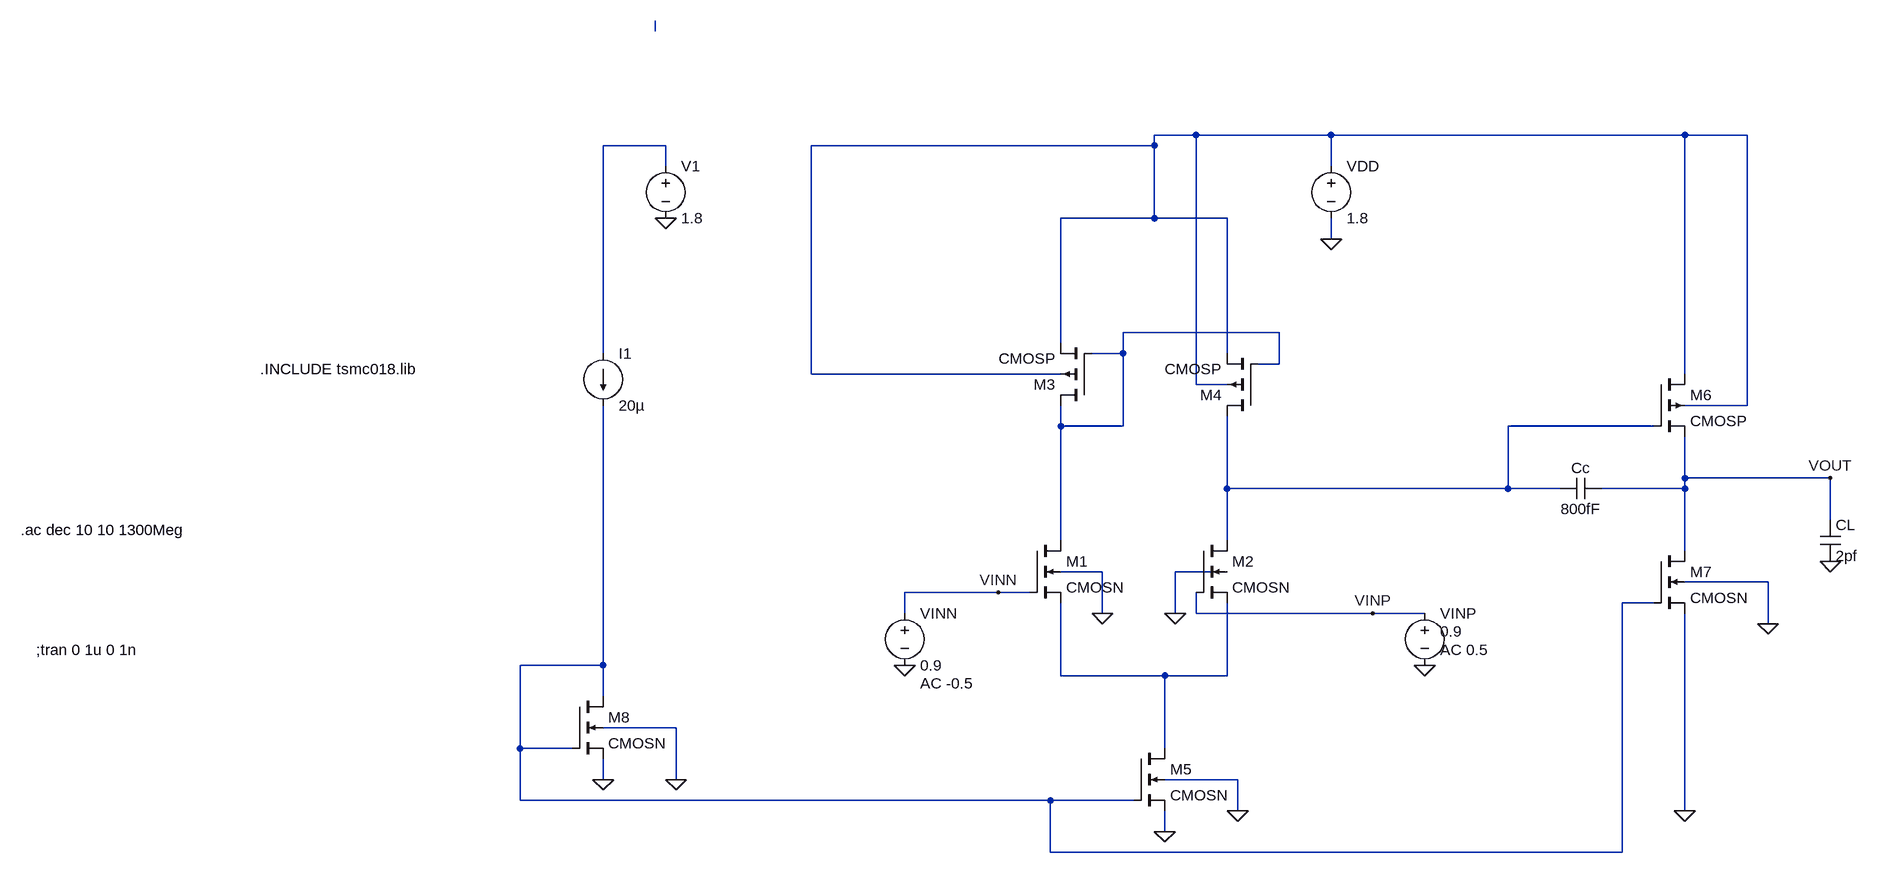
[diagram p0: schematic Draft3.asc]
Draft3.asc, the LTspice schematic file:
Version 4
SHEET 1 1328 784
WIRE -560 -704 -560 -720
WIRE 272 -544 208 -544
WIRE 480 -544 272 -544
WIRE 1024 -544 480 -544
WIRE 1120 -544 1024 -544
WIRE -544 -528 -640 -528
WIRE 208 -528 208 -544
WIRE 208 -528 -320 -528
WIRE -544 -496 -544 -528
WIRE 480 -496 480 -544
WIRE 208 -416 208 -528
WIRE 208 -416 64 -416
WIRE 320 -416 208 -416
WIRE 480 -384 480 -416
WIRE 400 -240 160 -240
WIRE 64 -224 64 -416
WIRE -640 -208 -640 -528
WIRE 160 -208 160 -240
WIRE 160 -208 112 -208
WIRE 320 -208 320 -416
WIRE 400 -192 400 -240
WIRE 400 -192 368 -192
WIRE -320 -176 -320 -528
WIRE 64 -176 -320 -176
WIRE 1024 -176 1024 -544
WIRE 272 -160 272 -544
WIRE 320 -160 272 -160
WIRE 1120 -128 1120 -544
WIRE 1120 -128 1024 -128
WIRE 64 -96 64 -128
WIRE 160 -96 160 -208
WIRE 160 -96 64 -96
WIRE 976 -96 752 -96
WIRE 1024 -16 1024 -80
WIRE 1248 -16 1024 -16
WIRE 320 0 320 -112
WIRE 752 0 752 -96
WIRE 752 0 320 0
WIRE 832 0 752 0
WIRE 1024 0 1024 -16
WIRE 1024 0 896 0
WIRE 1248 48 1248 -16
WIRE 64 80 64 -96
WIRE 320 80 320 0
WIRE 1024 96 1024 0
WIRE 128 128 64 128
WIRE 320 128 240 128
WIRE 1152 144 1024 144
WIRE -32 160 -176 160
WIRE 16 160 -32 160
WIRE 976 176 928 176
WIRE -176 192 -176 160
WIRE 128 192 128 128
WIRE 240 192 240 128
WIRE 272 192 272 160
WIRE 544 192 272 192
WIRE 624 192 544 192
WIRE 1152 208 1152 144
WIRE -640 272 -640 -128
WIRE -640 272 -768 272
WIRE 64 288 64 176
WIRE 224 288 64 288
WIRE 320 288 320 176
WIRE 320 288 224 288
WIRE -640 320 -640 272
WIRE -528 368 -640 368
WIRE -768 400 -768 272
WIRE -688 400 -768 400
WIRE 224 400 224 288
WIRE -640 448 -640 416
WIRE -528 448 -528 368
WIRE 336 448 224 448
WIRE -768 480 -768 400
WIRE 48 480 -768 480
WIRE 176 480 48 480
WIRE 336 496 336 448
WIRE 1024 496 1024 192
WIRE 224 528 224 496
WIRE 48 560 48 480
WIRE 928 560 928 176
WIRE 928 560 48 560
FLAG 224 528 0
FLAG 480 -384 0
FLAG -640 448 0
FLAG 1024 496 0
FLAG 128 192 0
FLAG 240 192 0
FLAG 336 496 0
FLAG 1152 208 0
FLAG -528 448 0
FLAG 1248 -16 VOUT
FLAG 1248 112 0
FLAG 544 192 VINP
FLAG -32 160 VINN
FLAG -176 272 0
FLAG 624 272 0
FLAG -544 -416 0
SYMBOL voltage 480 -512 R0
WINDOW 123 24 44 Left 2
WINDOW 39 0 0 Left 0
SYMATTR InstName VDD
SYMATTR Value 1.8
SYMBOL current -640 -208 R0
WINDOW 123 0 0 Left 0
WINDOW 39 0 0 Left 0
SYMATTR InstName I1
SYMATTR Value 20µ
SYMBOL cmosn 16 80 R0
SYMATTR InstName M1
SYMATTR Value2 l=500n w=3u
SYMBOL cmosn 272 80 R0
SYMATTR InstName M2
SYMATTR Value2 l=500n w=3u
SYMBOL cmosn -688 320 R0
SYMATTR InstName M8
SYMATTR Value2 l=250n w=3u
SYMBOL cmosn 176 400 R0
SYMATTR InstName M5
SYMATTR Value2 l=250n w=3u
SYMBOL cmosn 976 96 R0
SYMATTR InstName M7
SYMATTR Value2 l=500n w=37.5u
SYMBOL cmosp 112 -128 R180
SYMATTR InstName M3
SYMATTR Value2 l=250n w=3.5u
SYMBOL cmosp 368 -112 R180
SYMATTR InstName M4
SYMATTR Value2 l=250n w=3.5u
SYMBOL cmosp 976 -176 R0
SYMATTR InstName M6
SYMATTR Value2 l=180n w=51.33u
SYMBOL cap 1232 48 R0
SYMATTR InstName CL
SYMATTR Value 2pf
SYMBOL voltage 624 176 R0
WINDOW 123 24 72 Left 2
WINDOW 39 0 0 Left 0
WINDOW 3 24 44 Left 2
SYMATTR Value2 AC 0.5
SYMATTR Value 0.9
SYMATTR InstName VINP
SYMBOL voltage -176 176 R0
WINDOW 123 24 124 Left 2
WINDOW 39 0 0 Left 0
SYMATTR Value2 AC -0.5
SYMATTR InstName VINN
SYMATTR Value 0.9
SYMBOL voltage -544 -512 R0
WINDOW 123 0 0 Left 0
WINDOW 39 0 0 Left 0
SYMATTR InstName V1
SYMATTR Value 1.8
SYMBOL cap 832 16 R270
WINDOW 0 32 32 VTop 2
WINDOW 3 0 32 VBottom 2
SYMATTR InstName Cc
SYMATTR Value 800fF
TEXT -1168 -184 Left 2 !.INCLUDE tsmc018.lib
TEXT -1536 64 Left 2 !.ac dec 10 10 1300Meg
TEXT -1512 248 Left 2 !;tran 0 1u 0 1n

The netlist it stands for:
* Draft3.asc
VDD N002 0 1.8
I1 N003 N006 20µ
M1 N004 VINN N007 0 CMOSN l=500n w=3u
M2 N005 VINP N007 0 CMOSN l=500n w=3u
M8 N006 N006 0 0 CMOSN l=250n w=3u
M5 N007 N006 0 0 CMOSN l=250n w=3u
M7 VOUT N006 0 0 CMOSN l=500n w=37.5u
M3 N004 N004 N002 N002 CMOSP l=250n w=3.5u
M4 N005 N004 N002 N002 CMOSP l=250n w=3.5u
M6 N002 N005 VOUT N002 CMOSP l=180n w=51.33u
CL VOUT 0 2pf
VINP VINP 0 0.9 AC 0.5
VINN VINN 0 0.9 AC -0.5
V1 N003 0 1.8
Cc N005 VOUT 800fF
.model NMOS NMOS
.model PMOS PMOS
.lib standard.mos
.INCLUDE tsmc018.lib
.ac dec 10 10 1300Meg
;tran 0 1u 0 1n
.backanno
.end